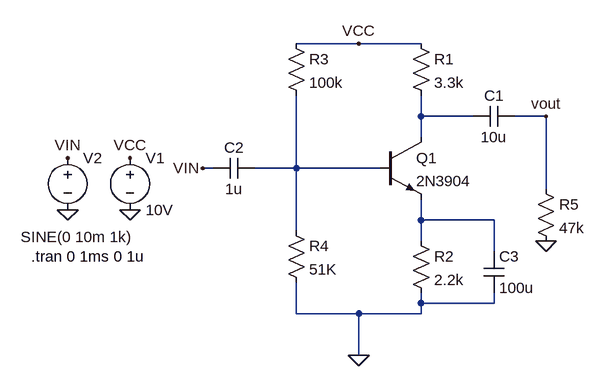
[diagram p0: schematic bjt_amp.asc]
bjt_amp.asc, the LTspice schematic file:
Version 4.1
SHEET 1 880 680
WIRE 320 -32 224 -32
WIRE 416 -32 320 -32
WIRE 416 80 416 48
WIRE 496 80 416 80
WIRE 608 80 560 80
WIRE 416 112 416 80
WIRE 96 160 80 160
WIRE 224 160 224 48
WIRE 224 160 160 160
WIRE 352 160 224 160
WIRE 608 192 608 80
WIRE 416 240 416 208
WIRE 528 240 416 240
WIRE 224 256 224 160
WIRE 416 272 416 240
WIRE 528 288 528 240
WIRE 416 368 416 352
WIRE 528 368 528 352
WIRE 528 368 416 368
WIRE 224 384 224 336
WIRE 320 384 224 384
WIRE 416 384 416 368
WIRE 416 384 320 384
WIRE 320 448 320 384
FLAG -32 224 0
FLAG -32 144 VCC
FLAG 320 -32 VCC
FLAG 320 448 0
FLAG -128 224 0
FLAG -128 144 VIN
FLAG 80 160 VIN
FLAG 608 272 0
FLAG 608 80 vout
SYMBOL voltage -32 128 R0
WINDOW 123 0 0 Left 0
WINDOW 39 0 0 Left 0
SYMATTR InstName V1
SYMATTR Value 10V
SYMBOL res 400 -48 R0
SYMATTR InstName R1
SYMATTR Value 3.3k
SYMBOL res 400 256 R0
SYMATTR InstName R2
SYMATTR Value 2.2k
SYMBOL res 208 -48 R0
SYMATTR InstName R3
SYMATTR Value 100k
SYMBOL res 208 240 R0
SYMATTR InstName R4
SYMATTR Value 51K
SYMBOL cap 560 64 R90
WINDOW 0 0 32 VBottom 2
WINDOW 3 32 32 VTop 2
SYMATTR InstName C1
SYMATTR Value 10u
SYMBOL cap 160 144 R90
WINDOW 0 0 32 VBottom 2
WINDOW 3 32 32 VTop 2
SYMATTR InstName C2
SYMATTR Value 1u
SYMBOL voltage -128 128 R0
WINDOW 3 -72 138 Left 2
WINDOW 123 0 0 Left 0
WINDOW 39 0 0 Left 0
SYMATTR Value SINE(0 10m 1k)
SYMATTR InstName V2
SYMBOL res 592 176 R0
SYMATTR InstName R5
SYMATTR Value 47k
SYMBOL cap 512 288 R0
SYMATTR InstName C3
SYMATTR Value 100u
SYMBOL npn 352 112 R0
SYMATTR InstName Q1
SYMATTR Value 2N3904
TEXT -184 296 Left 2 !.tran 0 1ms 0 1u

The netlist it stands for:
* bjt_amp.asc
V1 VCC 0 10V
R1 VCC N001 3.3k
R2 N003 0 2.2k
R3 VCC N002 100k
R4 N002 0 51K
C1 vout N001 10u
C2 N002 VIN 1u
V2 VIN 0 SINE(0 10m 1k)
R5 vout 0 47k
C3 N003 0 100u
Q1 N001 N002 N003 0 2N3904
.model NPN NPN
.model PNP PNP
.lib standard.bjt
.tran 0 1ms 0 1u
.backanno
.end